# Altium schematic sheet Processor.SchDoc
size A4; SheetNumber: 2; SheetTotal: 11
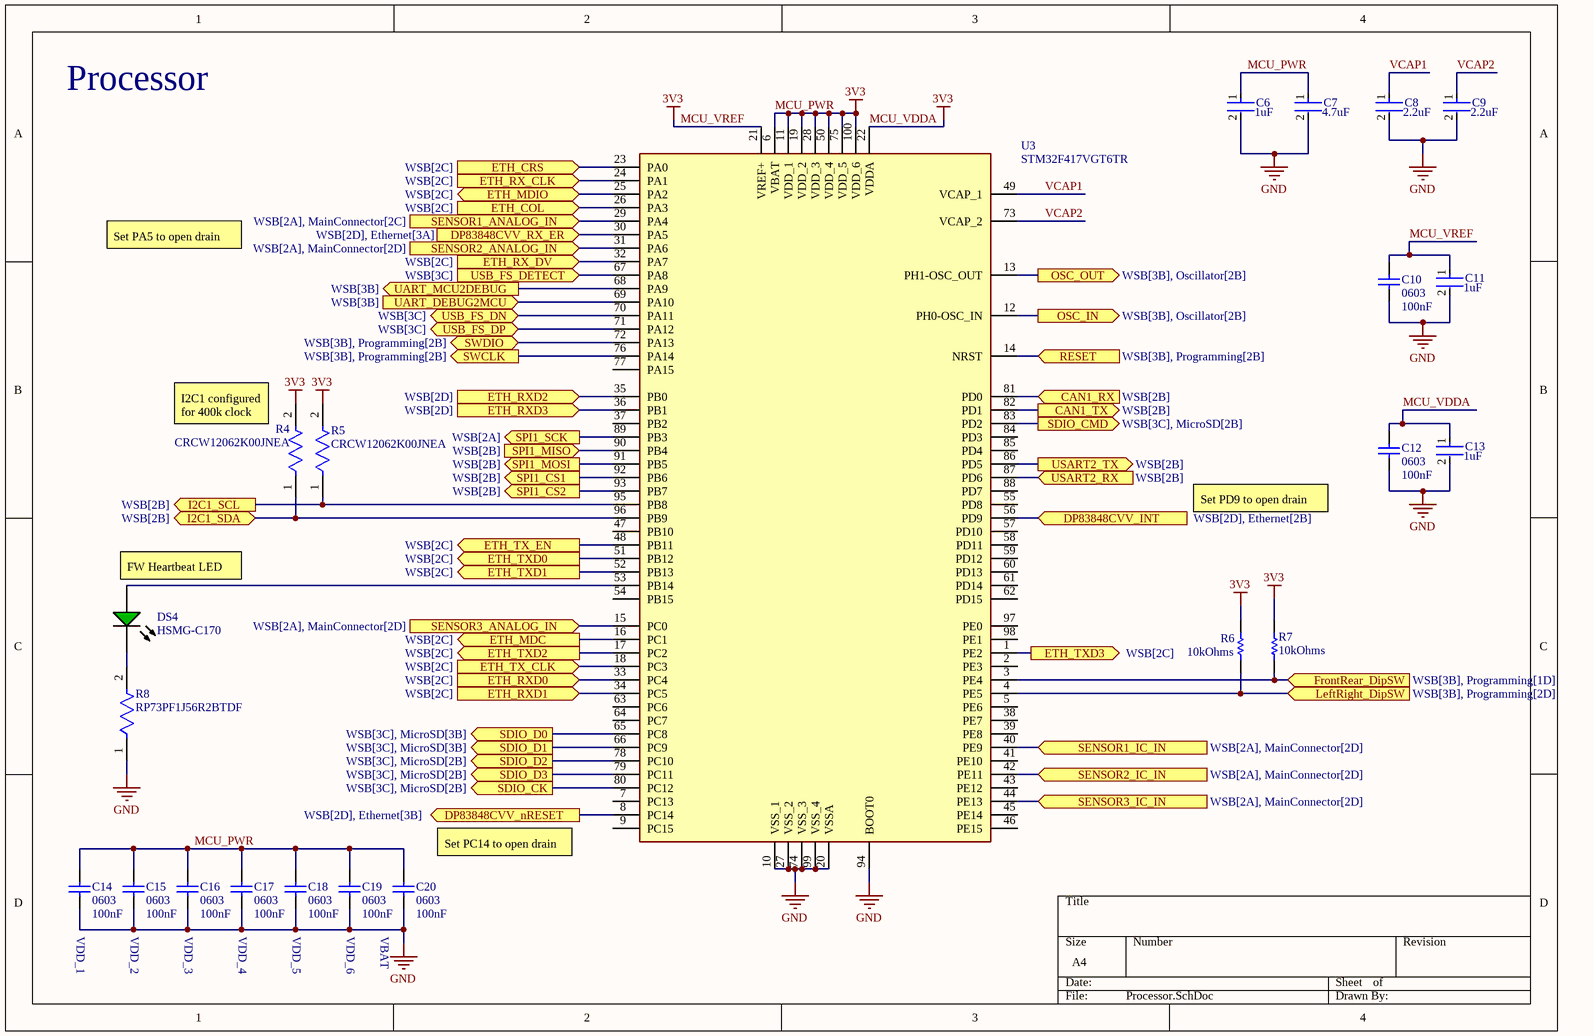
[diagram p0: Processor.SchDoc]

## Parts
C6  Capacitance: 1uF  [FP-CL10-IPC_C]  (hidden comment: CL10A105KA8NNNC)
C7  Capacitance: 4.7uF  [FP-C1005-050-0_15-MFG]  (hidden comment: C1005X5R1A475K050BC)
C8  Capacitance: 2.2uF  [FP-C0603C225K4PACTU-MFG]  (hidden comment: C0603C225K4PACTU)
C9  Capacitance: 2.2uF  [FP-C0603C225K4PACTU-MFG]  (hidden comment: C0603C225K4PACTU)
C10  Case Code (Imperial): 0603  Capacitance: 100nF  [CAPC1608X87X35NL15T15]  (hidden comment: C0603X104K5RACTU)
C11  Capacitance: 1uF  [FP-CL10-IPC_C]  (hidden comment: CL10A105KA8NNNC)
C12  Case Code (Imperial): 0603  Capacitance: 100nF  [CAPC1608X87X35NL15T15]  (hidden comment: C0603X104K5RACTU)
C13  Capacitance: 1uF  [FP-CL10-IPC_C]  (hidden comment: CL10A105KA8NNNC)
C14  Case Code (Imperial): 0603  Capacitance: 100nF  [CAPC1608X87X35NL15T15]  (hidden comment: C0603X104K5RACTU)
C15  Case Code (Imperial): 0603  Capacitance: 100nF  [CAPC1608X87X35NL15T15]  (hidden comment: C0603X104K5RACTU)
C16  Case Code (Imperial): 0603  Capacitance: 100nF  [CAPC1608X87X35NL15T15]  (hidden comment: C0603X104K5RACTU)
C17  Case Code (Imperial): 0603  Capacitance: 100nF  [CAPC1608X87X35NL15T15]  (hidden comment: C0603X104K5RACTU)
C18  Case Code (Imperial): 0603  Capacitance: 100nF  [CAPC1608X87X35NL15T15]  (hidden comment: C0603X104K5RACTU)
C19  Case Code (Imperial): 0603  Capacitance: 100nF  [CAPC1608X87X35NL15T15]  (hidden comment: C0603X104K5RACTU)
C20  Case Code (Imperial): 0603  Capacitance: 100nF  [CAPC1608X87X35NL15T15]  (hidden comment: C0603X104K5RACTU)
DS4  HSMG-C170  [AVAG-HSMX-C170_V]
R4  CRCW12062K00JNEA  [FP-CRCW1206-e3-IPC_B]
R5  CRCW12062K00JNEA  [FP-CRCW1206-e3-IPC_B]
R6  Resistance: 10kOhms  [RESC1608X55X25ML10T15]  (hidden comment: RC0603JR-0710KL)
R7  Resistance: 10kOhms  [RESC1608X55X25ML10T15]  (hidden comment: RC0603JR-0710KL)
R8  RP73PF1J56R2BTDF  [FP-RP73P-1J-MFG]
U3  STM32F417VGT6TR  [STM-LQFP100_N]

## Ports
CAN1_RX (in, see WSB[2B]), CAN1_TX (out, see WSB[2B]), DP83848CVV_INT (in, see WSB[2D], Ethernet[2B]), DP83848CVV_nRESET (out, see WSB[2D], Ethernet[3B]), DP83848CVV_RX_ER (in, see WSB[2D], Ethernet[3A]), ETH_COL (in, see WSB[2C]), ETH_CRS (in, see WSB[2C]), ETH_MDC (out, see WSB[2C]), ETH_MDIO (bidir, see WSB[2C]), ETH_RX_CLK (in, see WSB[2C]), ETH_RX_DV (in, see WSB[2C]), ETH_RXD0 (in, see WSB[2C]), ETH_RXD1 (in, see WSB[2C]), ETH_RXD2 (in, see WSB[2D]), ETH_RXD3 (in, see WSB[2D]), ETH_TX_CLK (in, see WSB[2C]), ETH_TX_EN (out, see WSB[2C]), ETH_TXD0 (out, see WSB[2C]), ETH_TXD1 (out, see WSB[2C]), ETH_TXD2 (out, see WSB[2C]), ETH_TXD3 (out, see WSB[2C]), FrontRear_DipSW (in, see WSB[3B], Programming[1D]), I2C1_SCL (out, see WSB[2B]), I2C1_SDA (bidir, see WSB[2B]), LeftRight_DipSW (in, see WSB[3B], Programming[2D]), OSC_IN (out, see WSB[3B], Oscillator[2B]), OSC_OUT (out, see WSB[3B], Oscillator[2B]), RESET (in, see WSB[3B], Programming[2B]), SDIO_CK (out, see WSB[3C], MicroSD[2B]), SDIO_CMD (out, see WSB[3C], MicroSD[2B]), SDIO_D0 (out, see WSB[3C], MicroSD[3B]), SDIO_D1 (out, see WSB[3C], MicroSD[3B]), SDIO_D2 (out, see WSB[3C], MicroSD[2B]), SDIO_D3 (out, see WSB[3C], MicroSD[2B]), SENSOR1_ANALOG_IN (in, see WSB[2A], MainConnector[2C]), SENSOR1_IC_IN (in, see WSB[2A], MainConnector[2D]), SENSOR2_ANALOG_IN (in, see WSB[2A], MainConnector[2D]), SENSOR2_IC_IN (in, see WSB[2A], MainConnector[2D]), SENSOR3_ANALOG_IN (in, see WSB[2A], MainConnector[2D]), SENSOR3_IC_IN (in, see WSB[2A], MainConnector[2D]), SPI1_CS1 (out, see WSB[2B]), SPI1_CS2 (out, see WSB[2B]), SPI1_MISO (in, see WSB[2B]), SPI1_MOSI (out, see WSB[2B]), SPI1_SCK (out, see WSB[2A]), SWCLK (out, see WSB[3B], Programming[2B]), SWDIO (bidir, see WSB[3B], Programming[2B]), UART_DEBUG2MCU (in, see WSB[3B]), UART_MCU2DEBUG (out, see WSB[3B]), USART2_RX (in, see WSB[2B]), USART2_TX (out, see WSB[2B]), USB_FS_DETECT (in, see WSB[3C]), USB_FS_DN (bidir, see WSB[3C]), USB_FS_DP (bidir, see WSB[3C])

## Nets
GND: C6.2 C7.2 C8.2 C9.2 C10.2 C11.2 C12.2 C13.2 C14.1 C15.1 C16.1 C17.1 C18.1 C19.1 C20.1 R8.1 U3.10(VSS_1) U3.20(VSSA) U3.27(VSS_2) U3.74(VSS_3) U3.94(BOOT0) U3.99(VSS_4)
MCU_PWR: C6.1 C7.1 C10.1 C11.1 C12.1 C13.1 C14.2 C15.2 C16.2 C17.2 C18.2 C19.2 C20.2 R4.2 R5.2 R6.2 R7.2 U3.6(VBAT) U3.11(VDD_1) U3.19(VDD_2) U3.21(VREF+) U3.22(VDDA) U3.28(VDD_3) U3.50(VDD_4) U3.75(VDD_5) U3.100(VDD_6)  [also labelled 3V3, MCU_VDDA, MCU_VREF]
CAN1_RX: U3.81(PD0) ; port CAN1_RX
CAN1_TX: U3.82(PD1) ; port CAN1_TX
DP83848CVV_INT: U3.56(PD9) ; port DP83848CVV_INT
DP83848CVV_nRESET: U3.8(PC14) ; port DP83848CVV_nRESET
DP83848CVV_RX_ER: U3.30(PA5) ; port DP83848CVV_RX_ER
ETH_COL: U3.26(PA3) ; port ETH_COL
ETH_CRS: U3.23(PA0) ; port ETH_CRS
ETH_MDC: U3.16(PC1) ; port ETH_MDC
ETH_MDIO: U3.25(PA2) ; port ETH_MDIO
ETH_RX_CLK: U3.24(PA1) ; port ETH_RX_CLK
ETH_RX_DV: U3.32(PA7) ; port ETH_RX_DV
ETH_RXD0: U3.33(PC4) ; port ETH_RXD0
ETH_RXD1: U3.34(PC5) ; port ETH_RXD1
ETH_RXD2: U3.35(PB0) ; port ETH_RXD2
ETH_RXD3: U3.36(PB1) ; port ETH_RXD3
ETH_TX_CLK: U3.18(PC3) ; port ETH_TX_CLK
ETH_TX_EN: U3.48(PB11) ; port ETH_TX_EN
ETH_TXD0: U3.51(PB12) ; port ETH_TXD0
ETH_TXD1: U3.52(PB13) ; port ETH_TXD1
ETH_TXD2: U3.17(PC2) ; port ETH_TXD2
ETH_TXD3: U3.1(PE2) ; port ETH_TXD3
FrontRear_DipSW: R7.1 U3.3(PE4) ; port FrontRear_DipSW
I2C1_SCL: R5.1 U3.95(PB8) ; port I2C1_SCL
I2C1_SDA: R4.1 U3.96(PB9) ; port I2C1_SDA
LeftRight_DipSW: R6.1 U3.4(PE5) ; port LeftRight_DipSW
OSC_IN: U3.12(PH0-OSC_IN) ; port OSC_IN
OSC_OUT: U3.13(PH1-OSC_OUT) ; port OSC_OUT
RESET: U3.14(NRST) ; port RESET
SDIO_CK: U3.80(PC12) ; port SDIO_CK
SDIO_CMD: U3.83(PD2) ; port SDIO_CMD
SDIO_D0: U3.65(PC8) ; port SDIO_D0
SDIO_D1: U3.66(PC9) ; port SDIO_D1
SDIO_D2: U3.78(PC10) ; port SDIO_D2
SDIO_D3: U3.79(PC11) ; port SDIO_D3
SENSOR1_ANALOG_IN: U3.29(PA4) ; port SENSOR1_ANALOG_IN
SENSOR1_IC_IN: U3.40(PE9) ; port SENSOR1_IC_IN
SENSOR2_ANALOG_IN: U3.31(PA6) ; port SENSOR2_ANALOG_IN
SENSOR2_IC_IN: U3.42(PE11) ; port SENSOR2_IC_IN
SENSOR3_ANALOG_IN: U3.15(PC0) ; port SENSOR3_ANALOG_IN
SENSOR3_IC_IN: U3.44(PE13) ; port SENSOR3_IC_IN
SPI1_CS1: U3.92(PB6) ; port SPI1_CS1
SPI1_CS2: U3.93(PB7) ; port SPI1_CS2
SPI1_MISO: U3.90(PB4) ; port SPI1_MISO
SPI1_MOSI: U3.91(PB5) ; port SPI1_MOSI
SPI1_SCK: U3.89(PB3) ; port SPI1_SCK
SWCLK: U3.76(PA14) ; port SWCLK
SWDIO: U3.72(PA13) ; port SWDIO
UART_DEBUG2MCU: U3.69(PA10) ; port UART_DEBUG2MCU
UART_MCU2DEBUG: U3.68(PA9) ; port UART_MCU2DEBUG
USART2_RX: U3.87(PD6) ; port USART2_RX
USART2_TX: U3.86(PD5) ; port USART2_TX
USB_FS_DETECT: U3.67(PA8) ; port USB_FS_DETECT
USB_FS_DN: U3.70(PA11) ; port USB_FS_DN
USB_FS_DP: U3.71(PA12) ; port USB_FS_DP
VCAP1: C8.1 U3.49(VCAP_1)
VCAP2: C9.1 U3.73(VCAP_2)
NetDS4_1: DS4.1(A) U3.53(PB14)
NetDS4_2: DS4.2(K) R8.2

Not connected (* = marked no-connect by the designer): U3 2(PE3) 5(PE6) 7(PC13) 9(PC15) 37(PB2) 38(PE7) 39(PE8) 41(PE10) 43(PE12) 45(PE14) 46(PE15) 47(PB10) 54(PB15) 55(PD8) 57(PD10) 58(PD11) 59(PD12) 60(PD13) 61(PD14) 62(PD15) 63(PC6) 64(PC7) 77(PA15) 84(PD3) 85(PD4) 88(PD7) 97(PE0) 98(PE1)

## Notes on the sheet
- Processor
- Set PA5 to open drain
- (near R4) I2C1 configured for 400k clock
- Set PD9 to open drain
- (near DS4) FW Heartbeat LED
- Set PC14 to open drain
- VDD_1
- VDD_2
- VDD_3
- VDD_4
- VDD_5
- VDD_6
- VBAT

## Library data of the parts
C6 C11 C13 = CMP-13271-004127-1: Cap Ceramic 1uF 25V X5R ±10% Pad SMD 0603 +85°C T/R; Height: 0.8mm; Depth: 0.8mm; Package Quantity: 1; Mount: Surface Mount; Contact Plating: Tin; Voltage Rating: 25V; Dielectric: X5R; Packaging: Tape and Reel; Material: Ceramic; Case Code (Metric): 1608; Length: 1.6mm; Voltage: 25V; Min Operating Temperature: -55°C; Width: 0.031inch; Tolerance: 10%; Case/Package: 0603; Radiation Hardening: No; Case Code (Imperial): 0603; Thickness: 0.035inch; Lead Free: Lead Free; Max Operating Temperature: 85°C; Voltage Rating (DC): 25V
C7 = CMP-2000-05997-2: CAP CER 4.7UF 10V X5R 0402; Dielectric Material: Ceramic; Tolerance: 10%; Series: C; Package Quantity: 10000; Max Operating Temperature: 85°C; Case Code (Imperial): 0402; Lead Free: Lead Free; Voltage Rating (DC): 10V; Packaging: Cut Tape; Voltage Rating: 10V; Min Operating Temperature: -55°C; Dielectric: X5R; Thickness: 0.022inch; Width: 0.02inch; Case/Package: 0402; Case Code (Metric): 1005; Length: 0.039inch; RoHS Compliant: Yes; REACH SVHC: No SVHC; Mount: Surface Mount
C8 C9 = CMP-2006-02259-2: CAP CER 2.2UF 16V X5R 0603; Dielectric Material: Ceramic; Tolerance: 10%; Dissipation Factor: 5%; Series: C; Voltage Rating (DC): 16V; REACH SVHC: No SVHC; RoHS Compliant: Yes; Number of Pins: 2; Max Operating Temperature: 85°C; Voltage Rating: 16V; Min Operating Temperature: -55°C; Termination: SMD/SMT; Dielectric: X5R; Packaging: Tape and Reel; Contact Plating: Tin; Case Code (Metric): 1608; Height: 0.8mm; Case/Package: 0603; Width: 0.8mm; Construction: Flat; Depth: 0.8mm; Thickness: 0.034inch; Radiation Hardening: No; Length: 1.6mm; Mount: Surface Mount; Case Code (Imperial): 0603; Voltage: 16V; Package Quantity: 1; Lead Free: Lead Free
C10 C12 C14-C20 = CMP-2006-03300-1: Manufacturer: Kemet; Dielectric Material: Ceramic; Tolerance: 10%; Voltage Rating: 50V; Dielectric: X7R; Dissipation Factor: 2.5%; Part Number: C0603X104K5RACTU; Supplier 1: Digi-Key; Supplier Part Number 1: 399-7969-1-ND; Manufacturer Part Number: C0603X104K5RACTU; Stock 1: 2206541; Pricing 1: 1 = 0.21000, 10 = 0.14500, 100 = 0.07340, 500 = 0.05024, 1000 = 0.04444 (USD); RoHS: Yes; Mount: Surface Mount; Case/Package: 0603; Number of Pins: 2; Case Code (Metric): 1608; Min Operating Temperature: -55°C; Max Operating Temperature: 125°C; Packaging: Tape and Reel; Package Quantity: 1; Voltage Rating (DC): 50V; Termination: SMD/SMT; Voltage: 50V; Features: Soft Termination; Length: 1.6mm; Height: 0.8mm; Width: 0.8mm; Depth: 0.8mm; Thickness: 0.034inch; Radiation Hardening: No; REACH SVHC: No SVHC; ComponentLink1URL: https://datasheet.ciiva.com/7823/1776088-7823908.pdf?src-supplier=Element14; ComponentLink1Description: https://datasheet.ciiva.com/7823/1776088-7823908.pdf?src-supplier=Element14; ComponentLink2URL: https://datasheet.ciiva.com/26948/getdatasheetpartid-385607-26948458.pdf?src-supplier=Verical; ComponentLink2Description: https://datasheet.ciiva.com/26948/getdatasheetpartid-385607-26948458.pdf?src-supplier=Verical; ComponentLink3URL: https://datasheet.ciiva.com/7823/1776088-7823909.pdf?src-supplier=Element14; ComponentLink3Description: https://datasheet.ciiva.com/7823/1776088-7823909.pdf?src-supplier=Element14; ComponentLink4URL: https://datasheet.ciiva.com/6279/kem-c1013-x7r-ft-cap-smd-6279993.pdf?src-supplier=Digi-Key; ComponentLink4Description: https://datasheet.ciiva.com/6279/kem-c1013-x7r-ft-cap-smd-6279993.pdf?src-supplier=Digi-Key; ComponentLink5URL: https://datasheet.ciiva.com/28533/1918693-28533212.pdf?src-supplier=Element14; ComponentLink5Description: https://datasheet.ciiva.com/28533/1918693-28533212.pdf?src-supplier=Element14; ComponentLink6URL: https://datasheet.ciiva.com/6279/kem-c1013-x7r-ft-cap-smd-6279999.pdf?src-supplier=Digi-Key; ComponentLink6Description: https://datasheet.ciiva.com/6279/kem-c1013-x7r-ft-cap-smd-6279999.pdf?src-supplier=Digi-Key; ComponentLink7URL: https://datasheet.ciiva.com/6279/kem-c1013-x7r-ft-cap-smd-6279990.pdf?src-supplier=Digi-Key; ComponentLink7Description: https://datasheet.ciiva.com/6279/kem-c1013-x7r-ft-cap-smd-6279990.pdf?src-supplier=Digi-Key; ComponentLink8URL: https://datasheet.ciiva.com/14597/70096394-14597743.pdf?src-supplier=Allied+Electronics; ComponentLink8Description: https://datasheet.ciiva.com/14597/70096394-14597743.pdf?src-supplier=Allied+Electronics
DS4 = CMP-2000-05062-1: Chip LED, Green, 2.2 V, -40 to 85 degC, 2-Pin SMD, Pb-Free, Tape and Reel; Manufacturer: Avago; No. of Pins: 2; Peak Wavelength: 570nm; SVHC: NoSVHC(16-Jun-2014); Dominant Wavelength: 572nm; Forward Current If: 20mA; Viewing Angle: 170deg; Lens Shape: Rectangular; PIV Max: 5V; External Width: 1.25mm; LED Type: Standard; External Depth: 0.8mm; Opto Mounting Orientation: Top; Luminous Intensity: 15mcd; Luminous Intensity Min: 4mcd; Forward Voltage VF Max: 2.6V; External Length / Height: 2mm; Bulb Size: 1.25mmx1.4mm; Light Area Height: 1mm; Voltage Vf Typ: 2.2V; Operating Temperature Max: 85degC; Datasheet Version: Oct-08; MSL: MSL2A-4weeks; Peak Forward Current: 20mA; Package Description: 2-Pin Surface Mount Device, Body 2 x 1.25 mm, Height 0.8 mm; Datasheet URL: https://datasheet.ciiva.com/29280/180495-da-01-en-chip-led-hsmg-c170-gelb-gruen-29280971.pdf; Storage Temperature Min: -40degC; LED Colour: Green; Wavelength Typ: 570nm; Mounting Type: SMD; Forward Current If Max: 20mA; Dominant Wavelength Typ: 572nm; LED Mounting: SMD; Operating Temperature Range: -30degCto+85degC; Operating Temperature Min: -30degC; Manufacturer URL: http://www.avagotech.com/; Packaging: CutTape; Luminous Intensity Typ: 15mcd; Package Reference: HSMX-C170; Storage Temperature Max: 85degC; Opto Case Style: SMD; Forward Voltage: 2.2V
R4 R5 = CMP-2003-02030-2: RES Thick Film, 2kΩ, 5%, 0.25W, 200ppm/°C, 1206; Resistance: 2kR; Max Power Dissipation: 250mW; Voltage Rating: 200V; Case Code (Imperial): 1206; Min Operating Temperature: -55°C; Number of Pins: 2; Tolerance: 5%; Contact Plating: Tin; Temperature Coefficient: 200ppm/°C; Features: Automotive AEC-Q200; Max Operating Temperature: 155°C; Military Standard: Not; Package Quantity: 1; Radiation Hardening: No; Composition: Thick Film; Weight: 0.000353oz; Number of Terminations: 2; Width: 0.063inch; Length: 3.2mm; Depth: 1.6mm; Voltage Rating (DC): 200V; Power Rating: 250mW; Height: 0.024inch; Case/Package: 1206; Lead Free: Lead Free; Case Code (Metric): 3216; Packaging: Tape and Reel
R6 R7 = CMP-2000-05022-1: Resistor, 10 KOhm, +/- 5%, 100 mW, -55 to 155 degC, 0603 (1608 Metric), RoHS, Tape and Reel; Manufacturer: Yageo; Voltage Rating: 50V; Temperature Coefficient: 100PPM/C; Power Rating: 100mW; Package Reference: 603; Series: RC; Case Code - mm: 1608; Packaging: Reel; Datasheet URL: http://www.farnell.com/datasheets/443971.pdf; Datasheet Version: Rev. 4, 04/2009; Operating Temperature Range: -55Cto+155C; Product: ThickFilmResistorsGeneralPurpose; Package Description: 2-Pin Surface Mount Device, Body 1.6 x 0.8 mm; Manufacturer URL: http://www.yageo.com/; Case Code - in: 0603; Tolerance: 5%; Termination Style: SMD/SMT
R8 = CMP-03211-004918-1: RES SMD 56.2 OHM 0.1% 1/6W 0603; Manufacturer: TE Connectivity; Resistance: 56.2Ω; Value: 56.2Ω; Power Rating: 0.166W; Voltage Rating: 100V; Temperature Coefficient: 25ppm/°C; Tolerance: 0.001; ComponentLink2URL: https://www.te.com/commerce/DocumentDelivery/DDEController?Action=srchrtrv&DocNm=1773272&DocType=DS&DocLang=English; RoHS: TRUE; Temperature Range Low: -55°C; Octopart: https://octopart.com/rp73pf1j56r2btdf-te+connectivity-45466141; Ipc Land Pattern Name: RESC15580X45; Automotive: No; Category: Res; Lead Free: Yes; Device Class L2: Resistors; Device Class L3: Chip SMD Resistors; Temperature: -55°C to +155°C; Digikey Description: RES SMD 56.2 OHM 0.1% 1/6W 0603; ComponentLink2Description: Datasheet; Manufacturer Part Number: RP73PF1J56R2BTDF; Device Class L1: Passive Components; Composition: Thin Film; Series: RP73P; Temperature Range High: +155°C; Height: 0.55mm; Package: RP73P-1J
U3 = STM32F417VGT6TR: RISC Microcontroller, 32-Bit, FLASH, CORTEX-M4 CPU, 168MHz, CMOS, PQFP100; Manufacturer: STMicroelectronics; Package Body Material: Plastic; Max Frequency: 26MHz; Number of I/O Lines: 82; Package Equivalence Code: QFP100,.63SQ,20; Power Supplies: 2/3.3V; Speed: 168RPM; Max Supply Current: 109mA; Max Supply Voltage: 3.6V; Min Supply Voltage: 1.8V; Supply Voltage-Nom: 3.3V; Qualification Status: Not Qualified; Supplier 1: Mouser; Manufacturer Part Number: STM32F417VGT6TR; RoHS: Yes; Category: Microcontrollers; Stock 1: 905; Pricing 1: 1=15.23, 10=14, 25=13.42, 50=13.42, 100=11.9, 1000=11.87, 10000=11.87 (USD); Package Code: LFQFP; Number of Pins: 100; Package Shape: Square; Min Operating Temperature: -40°C; Max Operating Temperature: 85°C; JESD-30 Code: S-PQFP-G100; Package Style: FLATPACK, LOW PROFILE, FINE PITCHMeter; Surface Mount: Yes; Technology: CMOS; Terminal Form: Gull Wing; Terminal Position: QUAD; Length: 14mm; Width: 14mm; Height - Seated (Max): 1.6mm; Terminal Pitch: 0.5mm; Reach SVHC Compliant: Yes; RoHS Compliant: Yes; Temperature Grade: INDUSTRIAL; ComponentLink1URL: https://datasheet.ciiva.com:443/pdfs/VipMasterIC/IC/SGST/SGST-S-A0002807758/SGST-S-A0002807758-1.pdf?src-supplier=IHS+Markit; ComponentLink1Description: https://datasheet.ciiva.com:443/pdfs/VipMasterIC/IC/SGST/SGST-S-A0002807758/SGST-S-A0002807758-1.pdf?src-supplier=IHS+Markit; ComponentLink2URL: https://datasheet.ciiva.com/29987/dm00035129-29987056.pdf?src-supplier=Avnet; ComponentLink2Description: https://datasheet.ciiva.com/29987/dm00035129-29987056.pdf?src-supplier=Avnet; Supplier Part Number 1: 511-STM32F417VGT6TR